# Altium project OSSI-1 Interface Board.PrjPcb
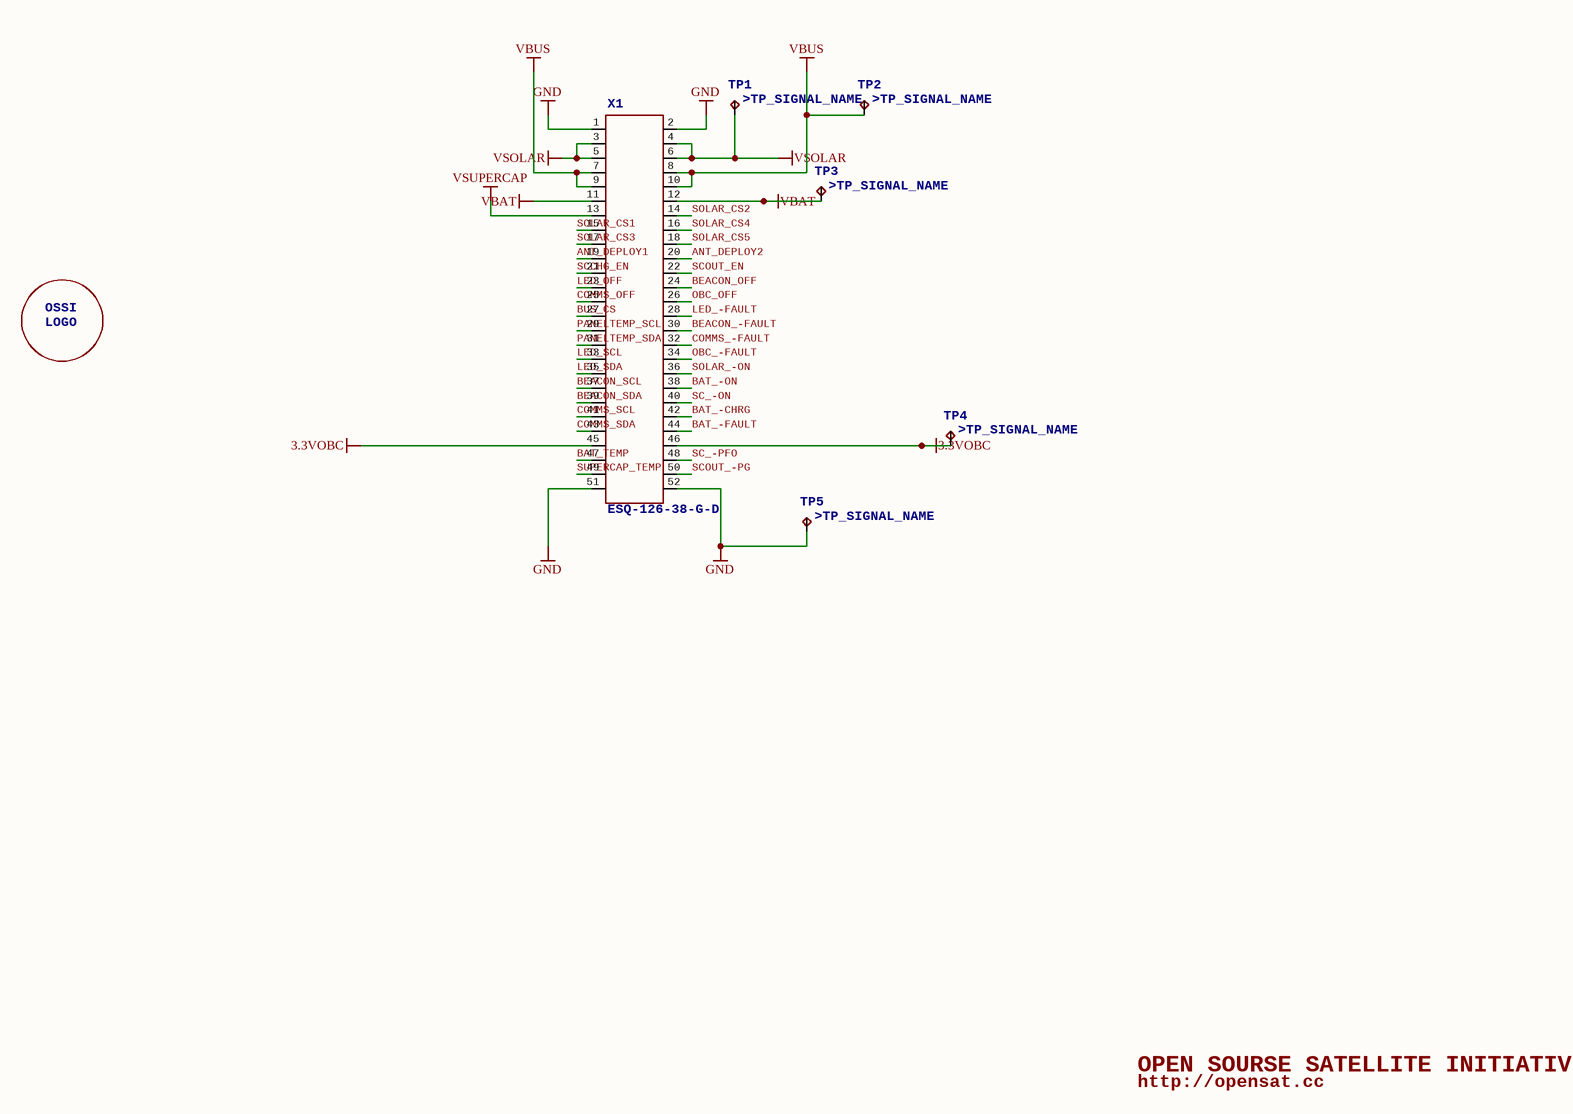
[diagram p0: OSSI-1 Interface Board_0.SchDoc]
2 sheets, 24 parts. Net scope: global (net labels, ports and power ports of the same name join across sheets).
Board file: OSSI-1 Interface Board.PcbDoc
Sheets:
  OSSI-1 Interface Board_0.SchDoc
  OSSI-1 Interface Board_1.SchDoc

## Sheet OSSI-1 Interface Board_0.SchDoc: TITLE:
size 410 x 286 mm; Date: Date:; >LAST_DATE_TIME: 01/11/2015 13:33:53; Sheet:: Sheet:; >SHEET: 1; REV:: REV:; Document Number:: Document Number:; >DRAWING_NAME: OSSI-1 Interface Board.sch

### Parts
TP1  >NAME: TP1  [TP-13]  (hidden comment: TP)
TP2  >NAME: TP2  [TP-13]  (hidden comment: TP)
TP3  >NAME: TP3  [TP-13]  (hidden comment: TP)
TP4  >NAME: TP4  [TP-13]  (hidden comment: TP)
TP5  >NAME: TP5  [TP-13]  (hidden comment: TP)
U$1  OSSILOGO-10  [OSSILOGO1010]  (value not drawn)
X1  >NAME: X1  [ESQ-126-XX-X-D]  (hidden comment: ESQ-126-38-G-D)

### Nets
3.3VOBC: TP4.TP X1.45 X1.46
GND: TP5.TP X1.1 X1.2 X1.51 X1.52
VBAT: TP3.TP X1.11 X1.12
VBUS: TP2.TP X1.7 X1.8 X1.9 X1.10
VSOLAR: TP1.TP X1.3 X1.4 X1.5 X1.6
VSUPERCAP: X1.13
ANT_DEPLOY1: X1.19
ANT_DEPLOY2: X1.20
BAT_-CHRG: X1.42
BAT_-FAULT: X1.44
BAT_-ON: X1.38
BAT_TEMP: X1.47
BEACON_-FAULT: X1.30
BEACON_OFF: X1.24
BEACON_SCL: X1.37
BEACON_SDA: X1.39
BUS_CS: X1.27
COMMS_-FAULT: X1.32
COMMS_OFF: X1.25
COMMS_SCL: X1.41
COMMS_SDA: X1.43
LED_-FAULT: X1.28
LED_OFF: X1.23
LED_SCL: X1.33
LED_SDA: X1.35
OBC_-FAULT: X1.34
OBC_OFF: X1.26
PANELTEMP_SCL: X1.29
PANELTEMP_SDA: X1.31
SC_-ON: X1.40
SC_-PFO: X1.48
SCCHG_EN: X1.21
SCOUT_-PG: X1.50
SCOUT_EN: X1.22
SOLAR_-ON: X1.36
SOLAR_CS1: X1.15
SOLAR_CS2: X1.14
SOLAR_CS3: X1.17
SOLAR_CS4: X1.16
SOLAR_CS5: X1.18
SUPERCAP_TEMP: X1.49

### Notes on the sheet
- OPEN SOURSE SATELLITE INITIATIVE
- http://opensat.cc

### Library data of the parts
X1 = ESQ-126-38-G-D: <b>Samtec ESQ-126-XX-G-D Elevated Sockets Seires</b> / <ul> / <li> ESQ-126-37-G-D</li> / <li> ESQ-126-38-G-D</li> / <li> ESQ-126-39-G-D</li> / </ul>; >VALUE: ESQ-126-38-G-D
TP1-TP5 = TP: >TP_SIGNAL_NAME: >TP_SIGNAL_NAME
U$1 = OSSILOGO-10: OSSI: OSSI; LOGO: LOGO

## Sheet OSSI-1 Interface Board_1.SchDoc: TITLE:
size 410 x 286 mm; Date: Date:; >LAST_DATE_TIME: 01/11/2015 13:33:59; Sheet:: Sheet:; >SHEET: 2; REV:: REV:; Document Number:: Document Number:; >DRAWING_NAME: OSSI-1 Interface Board.sch
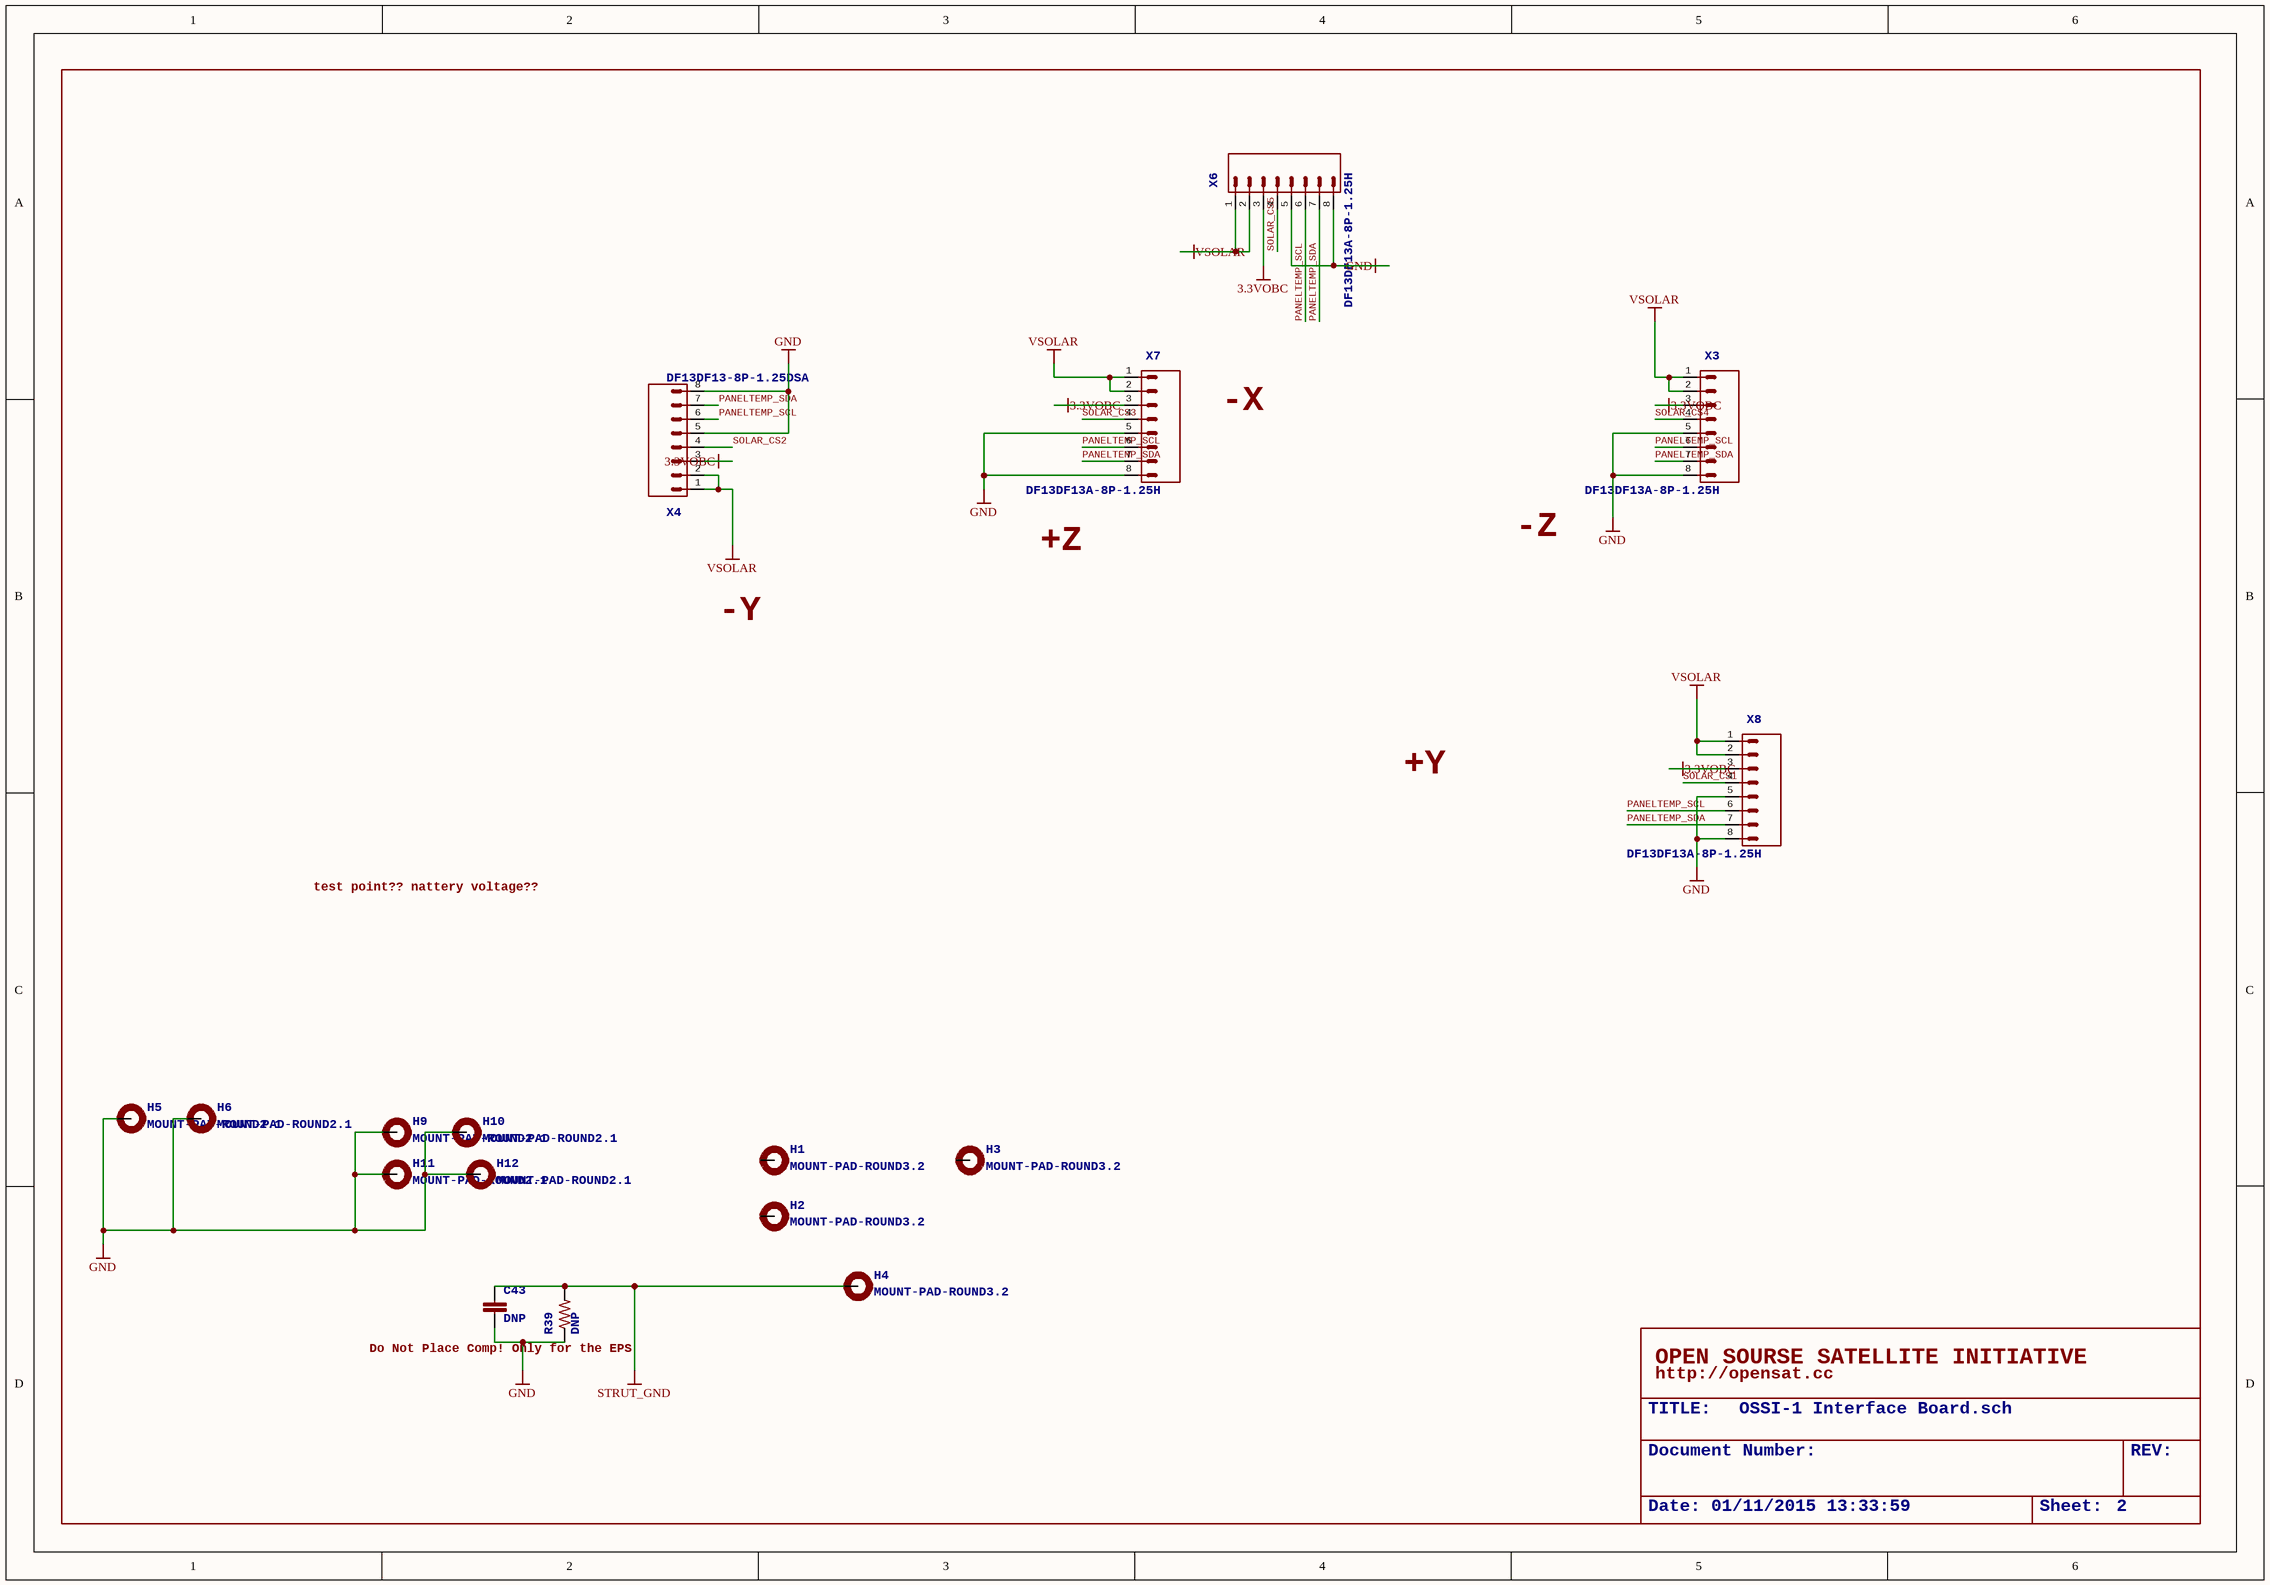
[diagram p1: OSSI-1 Interface Board_1.SchDoc]

### Parts
C43  >NAME: C43  [C0805(2012)]  (hidden comment: DNP)
H1  >NAME: H1  [3.2-PAD-ROUND]  (hidden comment: MOUNT-PAD-ROUND3.2)
H2  >NAME: H2  [3.2-PAD-ROUND]  (hidden comment: MOUNT-PAD-ROUND3.2)
H3  >NAME: H3  [3.2-PAD-ROUND]  (hidden comment: MOUNT-PAD-ROUND3.2)
H4  >NAME: H4  [3.2-PAD-ROUND]  (hidden comment: MOUNT-PAD-ROUND3.2)
H5  >NAME: H5  [2.1-PAD-ROUND]  (hidden comment: MOUNT-PAD-ROUND2.1)
H6  >NAME: H6  [2.1-PAD-ROUND]  (hidden comment: MOUNT-PAD-ROUND2.1)
H9  >NAME: H9  [2.1-PAD-ROUND]  (hidden comment: MOUNT-PAD-ROUND2.1)
H10  >NAME: H10  [2.1-PAD-ROUND]  (hidden comment: MOUNT-PAD-ROUND2.1)
H11  >NAME: H11  [2.1-PAD-ROUND]  (hidden comment: MOUNT-PAD-ROUND2.1)
H12  >NAME: H12  [2.1-PAD-ROUND]  (hidden comment: MOUNT-PAD-ROUND2.1)
R39  >NAME: R39  [WSL1206]  (hidden comment: DNP)
X3  >NAME: X3  [DF13A-8P]  (hidden comment: DF13DF13A-8P-1.25H)
X4  >NAME: X4  [DF13-8P-1.25DSA]  (hidden comment: DF13DF13-8P-1.25DSA)
X6  >NAME: X6  [DF13A-8P]  (hidden comment: DF13DF13A-8P-1.25H)
X7  >NAME: X7  [DF13A-8P]  (hidden comment: DF13DF13A-8P-1.25H)
X8  >NAME: X8  [DF13A-8P]  (hidden comment: DF13DF13A-8P-1.25H)

### Nets
3.3VOBC: X3.3 X4.3 X6.3 X7.3 X8.3
GND: C43.2 H5.B3,2(MOUNT) H6.B3,2(MOUNT) H9.B3,2(MOUNT) H10.B3,2(MOUNT) H11.B3,2(MOUNT) H12.B3,2(MOUNT) R39.P$1 X3.5 X3.8 X4.5 X4.8 X6.5 X6.8 X7.5 X7.8 X8.5 X8.8
STRUT_GND: C43.1 H4.B3,2(MOUNT) R39.P$2
VSOLAR: X3.1 X3.2 X4.1 X4.2 X6.1 X6.2 X7.1 X7.2 X8.1 X8.2
PANELTEMP_SCL: X3.6 X4.6 X6.6 X7.6 X8.6
PANELTEMP_SDA: X3.7 X4.7 X6.7 X7.7 X8.7
SOLAR_CS1: X8.4
SOLAR_CS2: X4.4
SOLAR_CS3: X7.4
SOLAR_CS4: X3.4
SOLAR_CS5: X6.4

Not connected (* = marked no-connect by the designer): H1 B3,2(MOUNT); H2 B3,2(MOUNT); H3 B3,2(MOUNT)

### Notes on the sheet
- -X
- +Z
- -Z
- -Y
- +Y
- test point?? nattery voltage??
- (near R39) Do Not Place Comp! Only for the EPS
- OPEN SOURSE SATELLITE INITIATIVE
- http://opensat.cc

### Library data of the parts
C43 = C0805(2012): >VALUE: DNP
R39 = RWSL1206: >VALUE: DNP
X3 X6-X8 = DF13DF13A-8P-1.25H: Hirose DF13 series connector; >VALUE: DF13DF13A-8P-1.25H
X4 = DF13DF13-8P-1.25DSA: Hirose DF13 series connector; >VALUE: DF13DF13-8P-1.25DSA
H1-H4 = MOUNT-PAD-ROUND3.2: >VALUE: MOUNT-PAD-ROUND3.2
H5 H6 H9-H12 = MOUNT-PAD-ROUND2.1: >VALUE: MOUNT-PAD-ROUND2.1

## Nets that join several sheets
3.3VOBC: OSSI-1 Interface Board_0 (TP4.TP X1.45 X1.46), OSSI-1 Interface Board_1 (5 pins)
GND: OSSI-1 Interface Board_0 (5 pins), OSSI-1 Interface Board_1 (18 pins)
VSOLAR: OSSI-1 Interface Board_0 (5 pins), OSSI-1 Interface Board_1 (10 pins)
PANELTEMP_SCL: OSSI-1 Interface Board_0 (X1.29), OSSI-1 Interface Board_1 (5 pins)
PANELTEMP_SDA: OSSI-1 Interface Board_0 (X1.31), OSSI-1 Interface Board_1 (5 pins)
SOLAR_CS1: OSSI-1 Interface Board_0 (X1.15), OSSI-1 Interface Board_1 (X8.4)
SOLAR_CS2: OSSI-1 Interface Board_0 (X1.14), OSSI-1 Interface Board_1 (X4.4)
SOLAR_CS3: OSSI-1 Interface Board_0 (X1.17), OSSI-1 Interface Board_1 (X7.4)
SOLAR_CS4: OSSI-1 Interface Board_0 (X1.16), OSSI-1 Interface Board_1 (X3.4)
SOLAR_CS5: OSSI-1 Interface Board_0 (X1.18), OSSI-1 Interface Board_1 (X6.4)